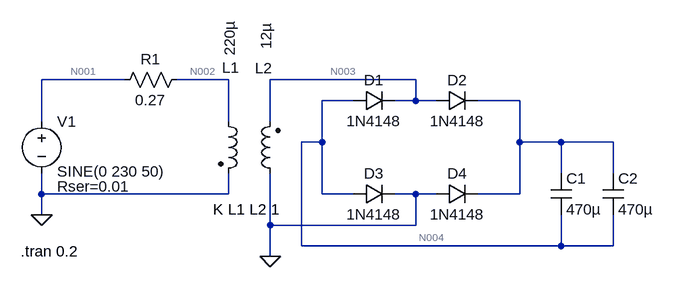
[diagram p0: schematic AC-DC.asc]
AC-DC.asc, the LTspice schematic file:
Version 4
SHEET 1 1000 680
WIRE 176 -16 48 -16
WIRE 336 -16 256 -16
WIRE 624 -16 400 -16
WIRE 528 16 480 16
WIRE 624 16 624 -16
WIRE 624 16 592 16
WIRE 656 16 624 16
WIRE 784 16 720 16
WIRE 48 48 48 -16
WIRE 336 48 336 -16
WIRE 400 48 400 -16
WIRE 480 80 480 16
WIRE 480 80 448 80
WIRE 784 80 784 16
WIRE 848 80 784 80
WIRE 928 80 848 80
WIRE 848 128 848 80
WIRE 928 128 928 80
WIRE 48 160 48 128
WIRE 336 160 336 128
WIRE 336 160 48 160
WIRE 480 160 480 80
WIRE 528 160 480 160
WIRE 624 160 592 160
WIRE 656 160 624 160
WIRE 784 160 784 80
WIRE 784 160 720 160
WIRE 48 192 48 160
WIRE 400 208 400 128
WIRE 624 208 624 160
WIRE 624 208 400 208
WIRE 448 240 448 80
WIRE 848 240 848 192
WIRE 848 240 448 240
WIRE 928 240 928 192
WIRE 928 240 848 240
WIRE 400 256 400 208
FLAG 48 192 0
FLAG 400 256 0
SYMBOL voltage 48 32 R0
WINDOW 3 24 93 Left 2
WINDOW 39 24 116 Left 2
SYMATTR Value SINE(0 230 50)
SYMATTR SpiceLine Rser=0.01
SYMATTR InstName V1
SYMBOL res 272 -32 R90
WINDOW 0 0 56 VBottom 2
WINDOW 3 32 56 VTop 2
SYMATTR InstName R1
SYMATTR Value 0.27
SYMBOL ind2 320 32 R0
WINDOW 0 6 -67 Left 2
WINDOW 3 18 -85 VLeft 2
SYMATTR InstName L1
SYMATTR Value 220µ
SYMATTR Type ind
SYMBOL ind2 416 144 R180
WINDOW 0 12 178 Left 2
WINDOW 3 22 207 VRight 2
SYMATTR InstName L2
SYMATTR Value 12µ
SYMATTR Type ind
SYMBOL diode 528 32 R270
WINDOW 0 32 32 VTop 2
WINDOW 3 0 32 VBottom 2
SYMATTR InstName D1
SYMATTR Value 1N4148
SYMBOL diode 656 32 R270
WINDOW 0 32 32 VTop 2
WINDOW 3 0 32 VBottom 2
SYMATTR InstName D2
SYMATTR Value 1N4148
SYMBOL diode 528 176 R270
WINDOW 0 32 32 VTop 2
WINDOW 3 0 32 VBottom 2
SYMATTR InstName D3
SYMATTR Value 1N4148
SYMBOL diode 656 176 R270
WINDOW 0 32 32 VTop 2
WINDOW 3 0 32 VBottom 2
SYMATTR InstName D4
SYMATTR Value 1N4148
SYMBOL cap 832 128 R0
SYMATTR InstName C1
SYMATTR Value 470µ
SYMBOL cap 912 128 R0
SYMATTR InstName C2
SYMATTR Value 470µ
TEXT 312 184 Left 2 !K L1 L2 1
TEXT 16 248 Left 2 !.tran 0.2

The netlist it stands for:
* AC-DC.asc
V1 N001 0 SINE(0 230 50) Rser=0.01
R1 N002 N001 0.27
L1 N002 0 220µ
L2 0 N003 12µ
D1 N004 N003 1N4148
D2 N003 N005 1N4148
D3 N004 0 1N4148
D4 0 N005 1N4148
C1 N005 N004 470µ
C2 N005 N004 470µ
.model D D
.lib standard.dio
K L1 L2 1
.tran 0.2
.backanno
.end

* Results of the author's LTspice run, read from the files saved beside the schematic
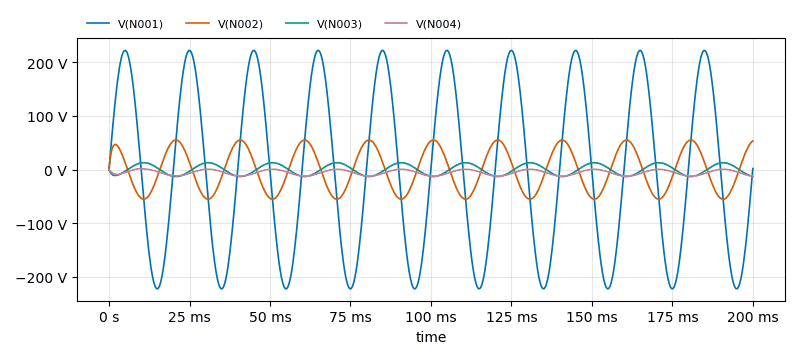
[diagram p1: Transient Analysis of AC-DC.asc, plotted from the saved traces]
* Transient Analysis, 1 run:
*   V(N001): min -222 V, max 222.1 V, average -7.061 mV, rms 157.1 V, last 1.912 V
*   V(N002): min -55.11 V, max 55.09 V, average -214 mV, rms 38.76 V, last 53.53 V
*   V(N003): min -12.87 V, max 12.87 V, average 49.97 mV, rms 9.051 V, last -12.5 V
*   V(N004): min -12.18 V, max 1.605 V, average -5.528 V, rms 7.148 V, last -12 V